# Altium schematic sheet Skytanic Template.SchDoc
size B; Organization: Altium Limited; Address1: L3, 12a Rodborough Rd; Address2: Frenchs Forest; Address3: NSW; Address4: Australia 2086
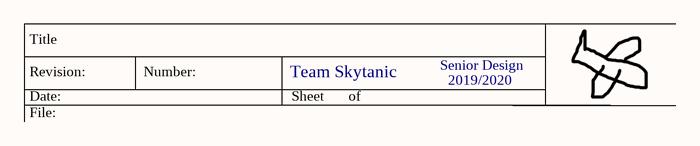
[diagram p0: Skytanic Template.SchDoc]

## Notes on the sheet
- Title
- Date:
- Revision:
- Number:
- Team Skytanic
- Sheet
- of
- Senior Design
- 2019/2020
- File: